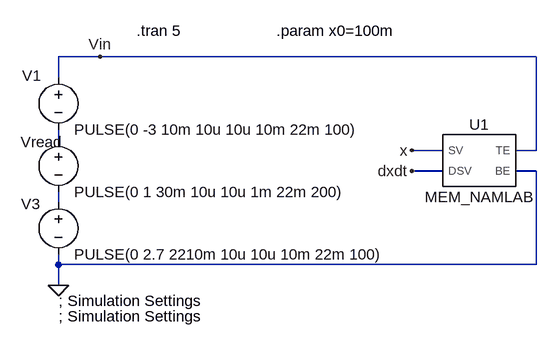
[diagram p0: schematic task4a.asc]
task4a.asc, the LTspice schematic file:
Version 4
SHEET 1 1352 680
WIRE -144 -160 -208 -160
WIRE 528 -160 -144 -160
WIRE -208 -128 -208 -160
WIRE -208 -32 -208 -48
WIRE 384 -16 336 -16
WIRE 528 -16 528 -160
WIRE 528 -16 496 -16
WIRE 384 16 336 16
WIRE 528 16 496 16
WIRE -208 64 -208 48
WIRE -208 160 -208 144
WIRE 528 160 528 16
WIRE 528 160 -208 160
WIRE -208 192 -208 160
FLAG -208 192 0
FLAG 336 -16 x
FLAG 336 16 dxdt
FLAG -144 -160 Vin
SYMBOL voltage -208 -144 R0
WINDOW 0 -56 13 Left 2
WINDOW 123 0 0 Left 0
WINDOW 39 0 0 Left 0
SYMATTR InstName V1
SYMATTR Value PULSE(0 -3 10m 10u 10u 10m 22m 100)
SYMBOL voltage -208 -48 R0
WINDOW 0 -58 19 Left 2
WINDOW 123 0 0 Left 0
WINDOW 39 0 0 Left 0
SYMATTR InstName Vread
SYMATTR Value PULSE(0 1 30m 10u 10u 1m 22m 200)
SYMBOL voltage -208 48 R0
WINDOW 0 -57 19 Left 2
WINDOW 123 0 0 Left 0
WINDOW 39 0 0 Left 0
SYMATTR InstName V3
SYMATTR Value PULSE(0 2.7 2210m 10u 10u 10m 22m 100)
SYMBOL MEM_NAMLAB 432 0 R0
SYMATTR InstName U1
TEXT -88 -200 Left 2 !.tran 5
TEXT 128 -200 Left 2 !.param x0=100m
TEXT -208 216 Left 2 !; Simulation Settings
TEXT -208 240 Left 2 !; Simulation Settings

The netlist it stands for:
* task4a.asc
V1 Vin N001 PULSE(0 -3 10m 10u 10u 10m 22m 100)
Vread N001 N002 PULSE(0 1 30m 10u 10u 1m 22m 200)
V3 N002 0 PULSE(0 2.7 2210m 10u 10u 10m 22m 100)
XU1 Vin 0 x dxdt MEM_NAMLAB  ; pins TE BE SV DSV
.tran 5
.param x0=100m
; Simulation Settings
; Simulation Settings
.lib .\MEM_NAMLAB.cir
.backanno
.end

* Results of the author's LTspice run, read from the files saved beside the schematic
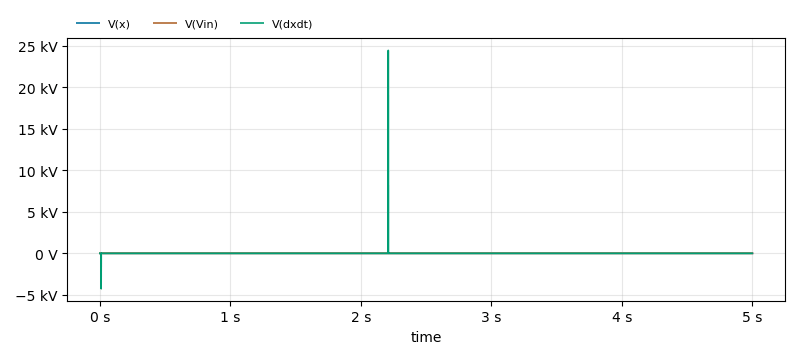
[diagram p1: Transient Analysis of task4a.asc, plotted from the saved traces]
* Transient Analysis, 1 run:
*   V(x): min 96.4 mV, max 226.3 mV, average 163.4 mV, rms 174.1 mV, last 226.3 mV
*   V(Vin): min -3 V, max 2.7 V, average -19.66 mV, rms 1.817 V, last 0 V
*   V(dxdt): min -4.266 kV, max 24.42 kV, average 25.46 mV, rms 14.2 V, last 0 V